# Altium project HYDRA_V3_NAV.PrjPcb (part 1 of 2)
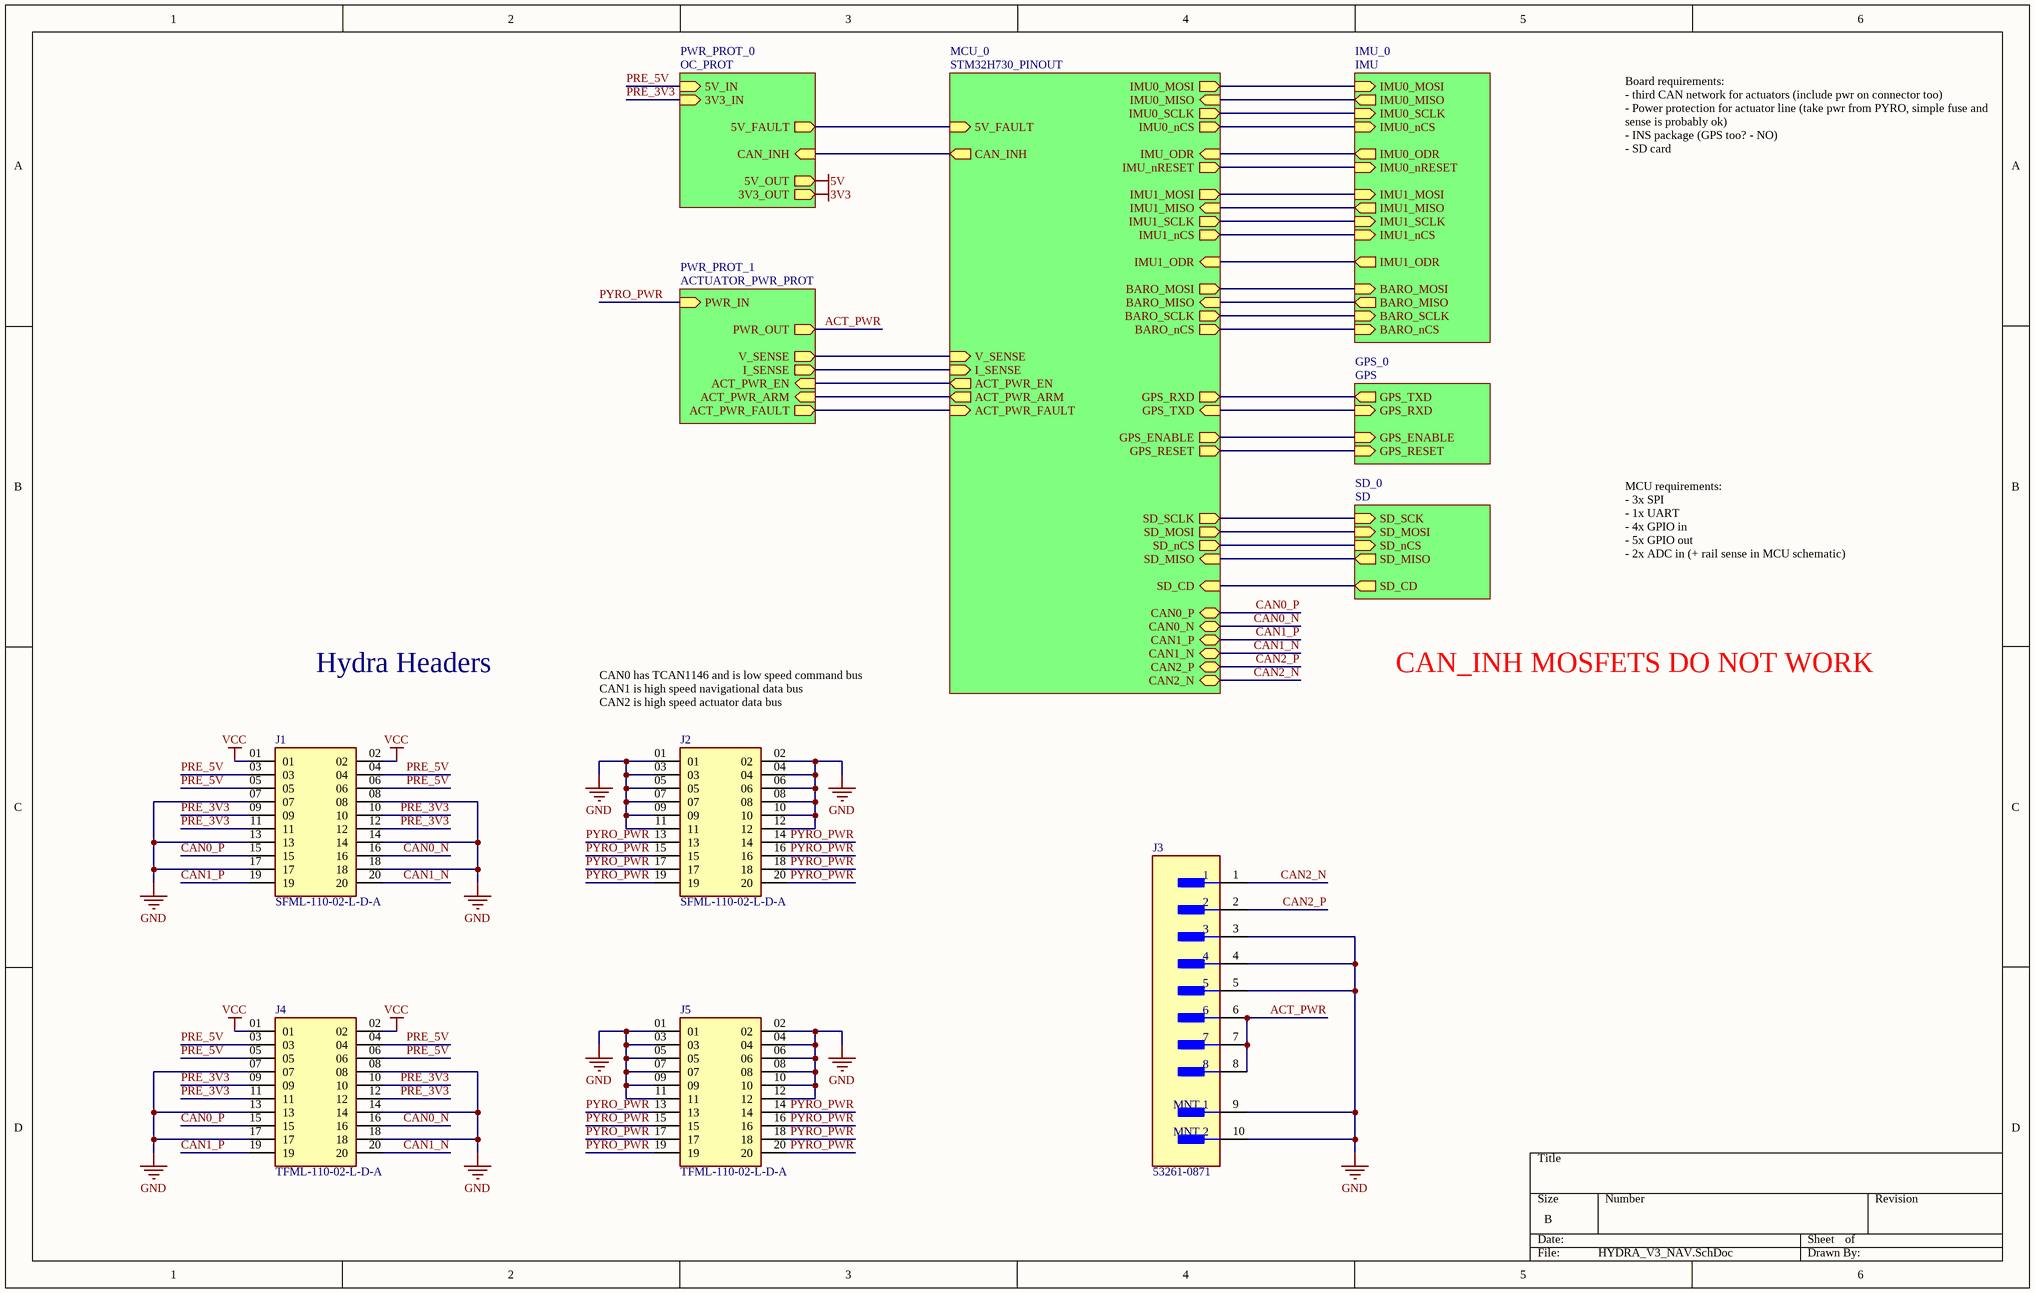
[diagram p0: HYDRA_V3_NAV.SchDoc]
7 sheets, 169 parts. Net scope: hierarchical (ports join the sheet entries above them; power ports are global).
Board file: HYDRA_V3_NAV.PcbDoc
Sheets:
  HYDRA_V3_NAV.SchDoc
    MCU_0 = STM32H730_PINOUT.SchDoc
    IMU_0 = IMU.SchDoc
    GPS_0 = GPS.SchDoc
    SD_0 = SD.SchDoc
    PWR_PROT_0 = OC_PROT.SchDoc
    PWR_PROT_1 = ACTUATOR_PWR_PROT.SchDoc

## Sheet HYDRA_V3_NAV.SchDoc
size B; SheetNumber: 1; SheetTotal: 7

### Parts
J1  SFML-110-02-L-D-A  [SFML-110-02-L-D-A-Footprint-1]
J2  SFML-110-02-L-D-A  [SFML-110-02-L-D-A-Footprint-1]
J3  53261-0871  [FP-532610871-MFG]
J4  TFML-110-02-L-D-A  [TFML-110-02-L-D-A-Footprint-1]
J5  TFML-110-02-L-D-A  [TFML-110-02-L-D-A-Footprint-1]

### Sub-sheets
GPS_0 = GPS: GPS_TXD (out), GPS_RXD (in), GPS_ENABLE (in), GPS_RESET (in)
IMU_0 = IMU: IMU0_MOSI (in), IMU0_MISO (out), IMU0_SCLK (in), IMU0_nCS (in), IMU0_ODR (out), IMU0_nRESET (in), IMU1_MOSI (in), IMU1_MISO (out), IMU1_SCLK (in), IMU1_nCS (in), IMU1_ODR (out), BARO_MOSI (in), BARO_MISO (out), BARO_SCLK (in), BARO_nCS (in)
MCU_0 = STM32H730_PINOUT: IMU_ODR (in), IMU_nRESET (out), BARO_MOSI (out), BARO_MISO (in), BARO_SCLK (out), BARO_nCS (out), V_SENSE (in), I_SENSE (in), 5V_FAULT (in), GPS_RXD (out), GPS_TXD (in), GPS_ENABLE (out), GPS_RESET (out), SD_SCLK (out), SD_MOSI (out), SD_nCS (out), SD_MISO (in), SD_CD (in), CAN0_P (bidir), CAN0_N (bidir), CAN1_P (bidir), CAN1_N (bidir), CAN2_P (bidir), CAN2_N (bidir), IMU1_MOSI (out), IMU1_MISO (in), IMU1_SCLK (out), IMU1_nCS (out), IMU1_ODR (in), CAN_INH (out), ACT_PWR_EN (out), ACT_PWR_ARM (out), ACT_PWR_FAULT (in), IMU0_MOSI (out), IMU0_MISO (in), IMU0_SCLK (out), IMU0_nCS (out)
PWR_PROT_0 = OC_PROT: 5V_OUT (out), 5V_IN (in), 3V3_IN (in), 3V3_OUT (out), 5V_FAULT (out), CAN_INH (in)
PWR_PROT_1 = ACTUATOR_PWR_PROT: PWR_IN (in), PWR_OUT (out), V_SENSE (out), I_SENSE (out), ACT_PWR_EN (in), ACT_PWR_ARM (in), ACT_PWR_FAULT (out)
SD_0 = SD: SD_SCK (in), SD_MOSI (in), SD_nCS (in), SD_MISO (out), SD_CD (out)

### Nets
5V: sheet PWR_PROT_0/5V_OUT
GND: J1.07 J1.08 J1.13 J1.14 J1.17 J1.18 J2.01 J2.02 J2.03 J2.04 J2.05 J2.06 J2.07 J2.08 J2.09 J2.10 J2.11 J2.12 J3.3 J3.4 J3.5 J3.9(MNT_1) J3.10(MNT_2) J4.07 J4.08 J4.13 J4.14 J4.17 J4.18 J5.01 J5.02 J5.03 J5.04 J5.05 J5.06 J5.07 J5.08 J5.09 J5.10 J5.11 J5.12
VCC: J1.01 J1.02 J4.01 J4.02
5V_FAULT: sheet MCU_0/5V_FAULT, sheet PWR_PROT_0/5V_FAULT
ACT_PWR: J3.6 J3.7 J3.8 ; sheet PWR_PROT_1/PWR_OUT
ACT_PWR_ARM: sheet MCU_0/ACT_PWR_ARM, sheet PWR_PROT_1/ACT_PWR_ARM
ACT_PWR_EN: sheet MCU_0/ACT_PWR_EN, sheet PWR_PROT_1/ACT_PWR_EN
ACT_PWR_FAULT: sheet MCU_0/ACT_PWR_FAULT, sheet PWR_PROT_1/ACT_PWR_FAULT
BARO_MISO: sheet MCU_0/BARO_MISO, sheet IMU_0/BARO_MISO
BARO_MOSI: sheet MCU_0/BARO_MOSI, sheet IMU_0/BARO_MOSI
BARO_nCS: sheet MCU_0/BARO_nCS, sheet IMU_0/BARO_nCS
BARO_SCLK: sheet MCU_0/BARO_SCLK, sheet IMU_0/BARO_SCLK
CAN0_N: J1.16 J4.16 ; sheet MCU_0/CAN0_N
CAN0_P: J1.15 J4.15 ; sheet MCU_0/CAN0_P
CAN1_N: J1.20 J4.20 ; sheet MCU_0/CAN1_N
CAN1_P: J1.19 J4.19 ; sheet MCU_0/CAN1_P
CAN2_N: J3.1 ; sheet MCU_0/CAN2_N
CAN2_P: J3.2 ; sheet MCU_0/CAN2_P
CAN_INH: sheet MCU_0/CAN_INH, sheet PWR_PROT_0/CAN_INH
GPS_ENABLE: sheet MCU_0/GPS_ENABLE, sheet GPS_0/GPS_ENABLE
GPS_RESET: sheet MCU_0/GPS_RESET, sheet GPS_0/GPS_RESET
I_SENSE: sheet MCU_0/I_SENSE, sheet PWR_PROT_1/I_SENSE
IMU0_MISO: sheet MCU_0/IMU0_MISO, sheet IMU_0/IMU0_MISO
IMU0_MOSI: sheet MCU_0/IMU0_MOSI, sheet IMU_0/IMU0_MOSI
IMU0_nCS: sheet MCU_0/IMU0_nCS, sheet IMU_0/IMU0_nCS
IMU0_nRESET: sheet MCU_0/IMU_nRESET, sheet IMU_0/IMU0_nRESET
IMU0_ODR: sheet MCU_0/IMU_ODR, sheet IMU_0/IMU0_ODR
IMU0_SCLK: sheet MCU_0/IMU0_SCLK, sheet IMU_0/IMU0_SCLK
IMU1_MISO: sheet MCU_0/IMU1_MISO, sheet IMU_0/IMU1_MISO
IMU1_MOSI: sheet MCU_0/IMU1_MOSI, sheet IMU_0/IMU1_MOSI
IMU1_nCS: sheet MCU_0/IMU1_nCS, sheet IMU_0/IMU1_nCS
IMU1_ODR: sheet MCU_0/IMU1_ODR, sheet IMU_0/IMU1_ODR
IMU1_SCLK: sheet MCU_0/IMU1_SCLK, sheet IMU_0/IMU1_SCLK
PRE_3V3: J1.09 J1.10 J1.11 J1.12 J4.09 J4.10 J4.11 J4.12 ; sheet PWR_PROT_0/3V3_IN  [project net 3V3_PRE_SHUNT]
PRE_5V: J1.03 J1.04 J1.05 J1.06 J4.03 J4.04 J4.05 J4.06 ; sheet PWR_PROT_0/5V_IN
PYRO_PWR: J2.13 J2.14 J2.15 J2.16 J2.17 J2.18 J2.19 J2.20 J5.13 J5.14 J5.15 J5.16 J5.17 J5.18 J5.19 J5.20 ; sheet PWR_PROT_1/PWR_IN  [project net PRE_SHUNT]
RXD: sheet MCU_0/GPS_TXD, sheet GPS_0/GPS_RXD
SD_CD: sheet MCU_0/SD_CD, sheet SD_0/SD_CD
SD_CLK: sheet MCU_0/SD_SCLK, sheet SD_0/SD_SCK
SD_CMD: sheet MCU_0/SD_MOSI, sheet SD_0/SD_MOSI
SD_CS: sheet MCU_0/SD_nCS, sheet SD_0/SD_nCS
SD_DAT0: sheet MCU_0/SD_MISO, sheet SD_0/SD_MISO
TXD: sheet MCU_0/GPS_RXD, sheet GPS_0/GPS_TXD
V_SENSE: sheet MCU_0/V_SENSE, sheet PWR_PROT_1/V_SENSE

### Notes on the sheet
- Board requirements:
  - third CAN network for actuators (include pwr on connector too)
  - Power protection for actuator line (take pwr from PYRO, simple fuse and sense is probably ok)
  - INS package (GPS too? - NO)
  - SD card
- MCU requirements:
  - 3x SPI
  - 1x UART
  - 4x GPIO in
  - 5x GPIO out
  - 2x ADC in (+ rail sense in MCU schematic)
- Hydra Headers
- CAN0 has TCAN1146 and is low speed command bus
  CAN1 is high speed navigational data bus
  CAN2 is high speed actuator data bus
- CAN_INH MOSFETS DO NOT WORK

### Library data of the parts
J1 J2 = CMP-002-00043-1: Board Connector, 20 Contact(s), 2 Row(s), Female, Straight, 0.05 inch Pitch, Surface Mount Terminal, Locking, Black Insulator, Socket; RoHS Compliant: Yes; Connector Type: BOARD CONNECTOR; Mounting Technology: Board
J3 = CMP-002-00053-1: Board Connector, 8 Contact(s), 1 Row(s), Male, Right Angle, 0.049 inch Pitch, Surface Mount Terminal, Locking, Natural Insulator, Receptacle; RoHS Compliant: Yes; Max Operating Temperature: 85°C; Min Operating Temperature: -40°C; Connector Type: BOARD CONNECTOR; Mounting Technology: Board
J4 J5 = CMP-002-00042-1: Board Connector, 20 Contact(s), 2 Row(s), Male, Straight, Surface Mount Terminal; Connector Type: BOARD CONNECTOR; Mounting Technology: Board; RoHS Compliant: Yes

## Sheet STM32H730_PINOUT.SchDoc
size D; SheetNumber: 3; SheetTotal: 7
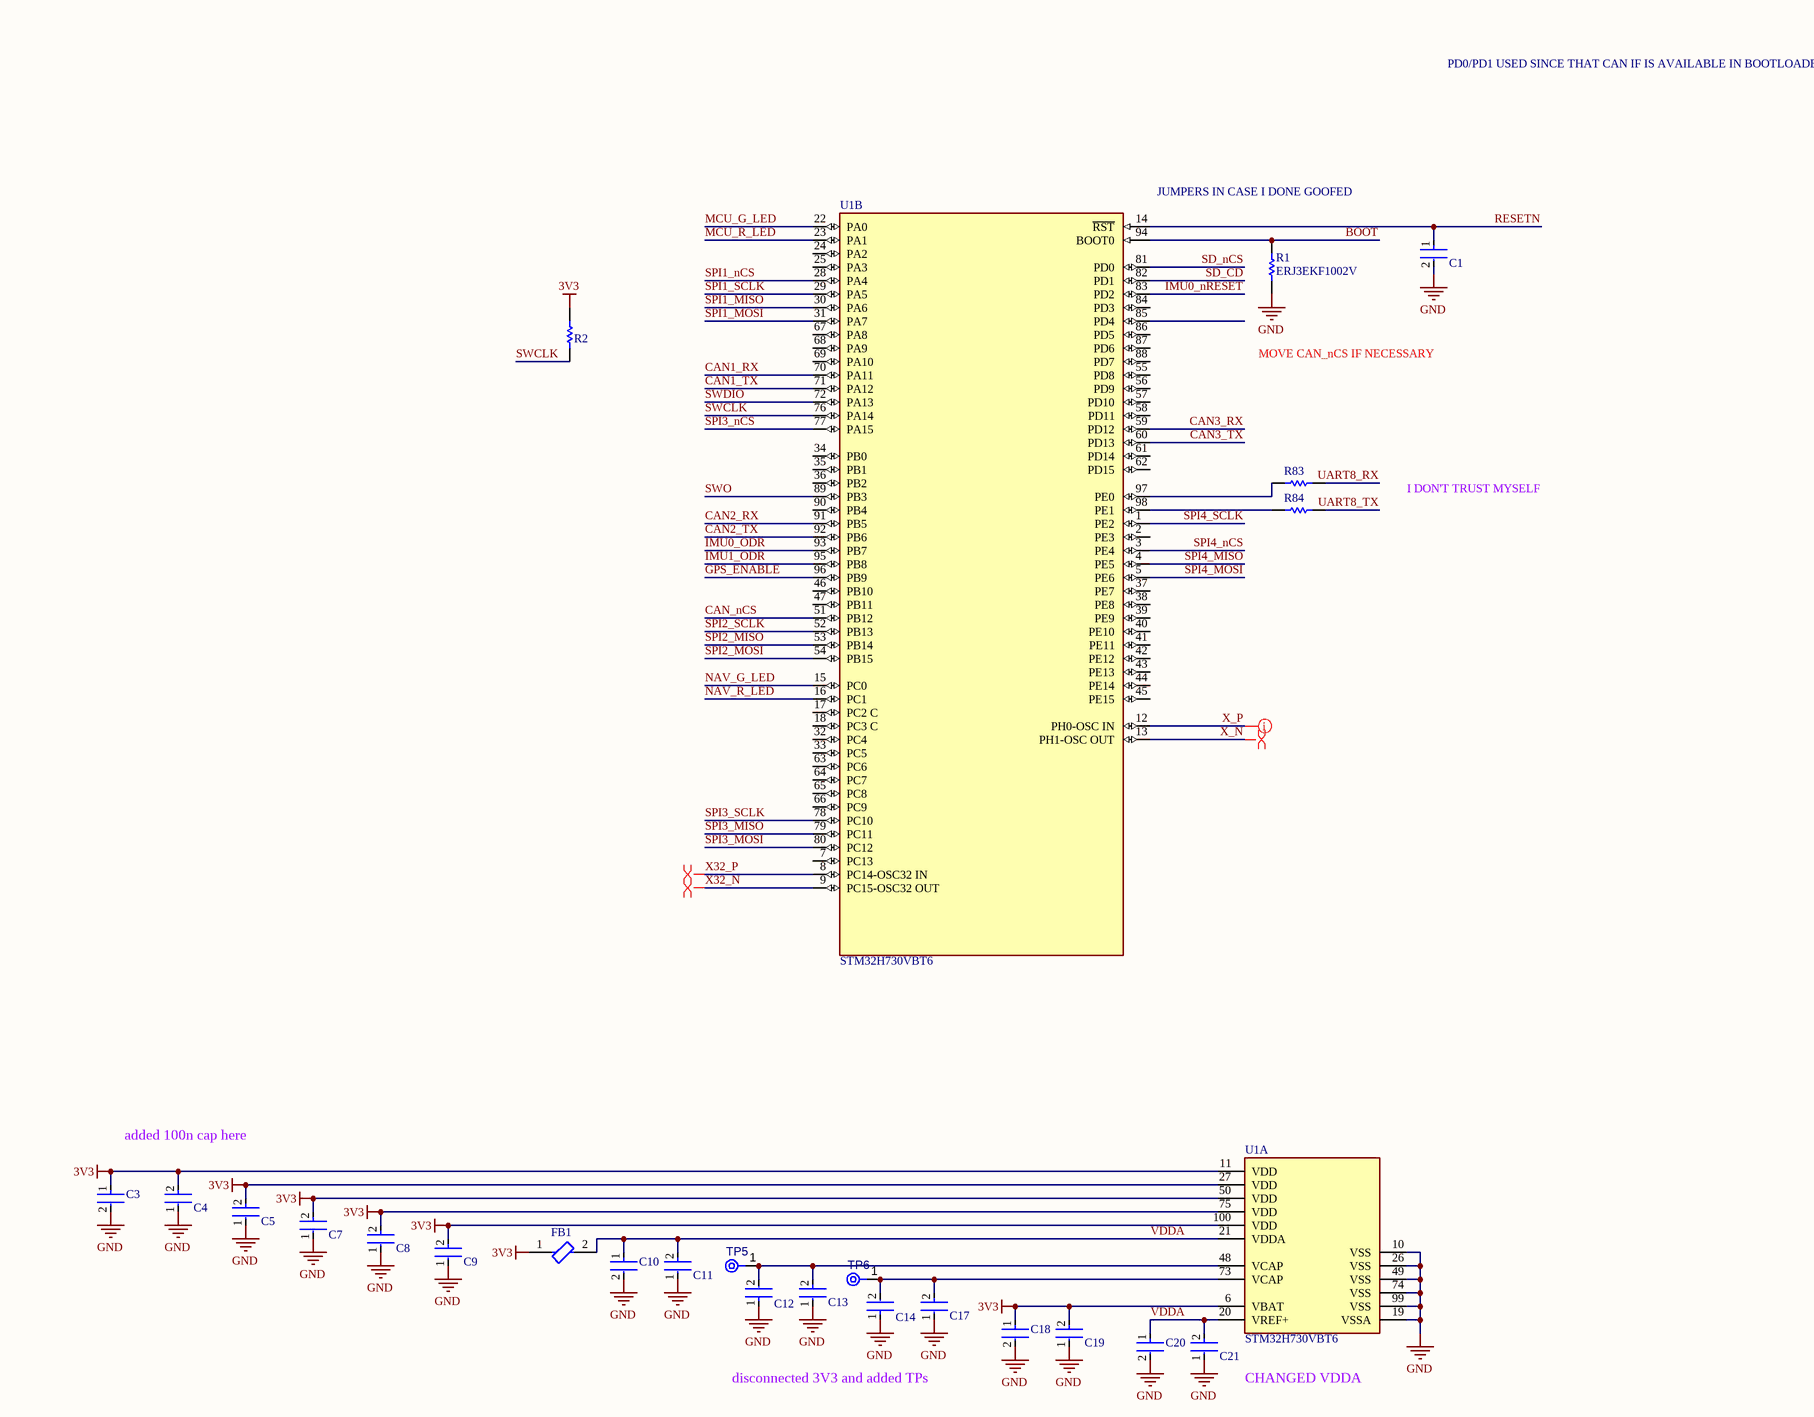
[diagram p1: STM32H730_PINOUT.SchDoc, top left]
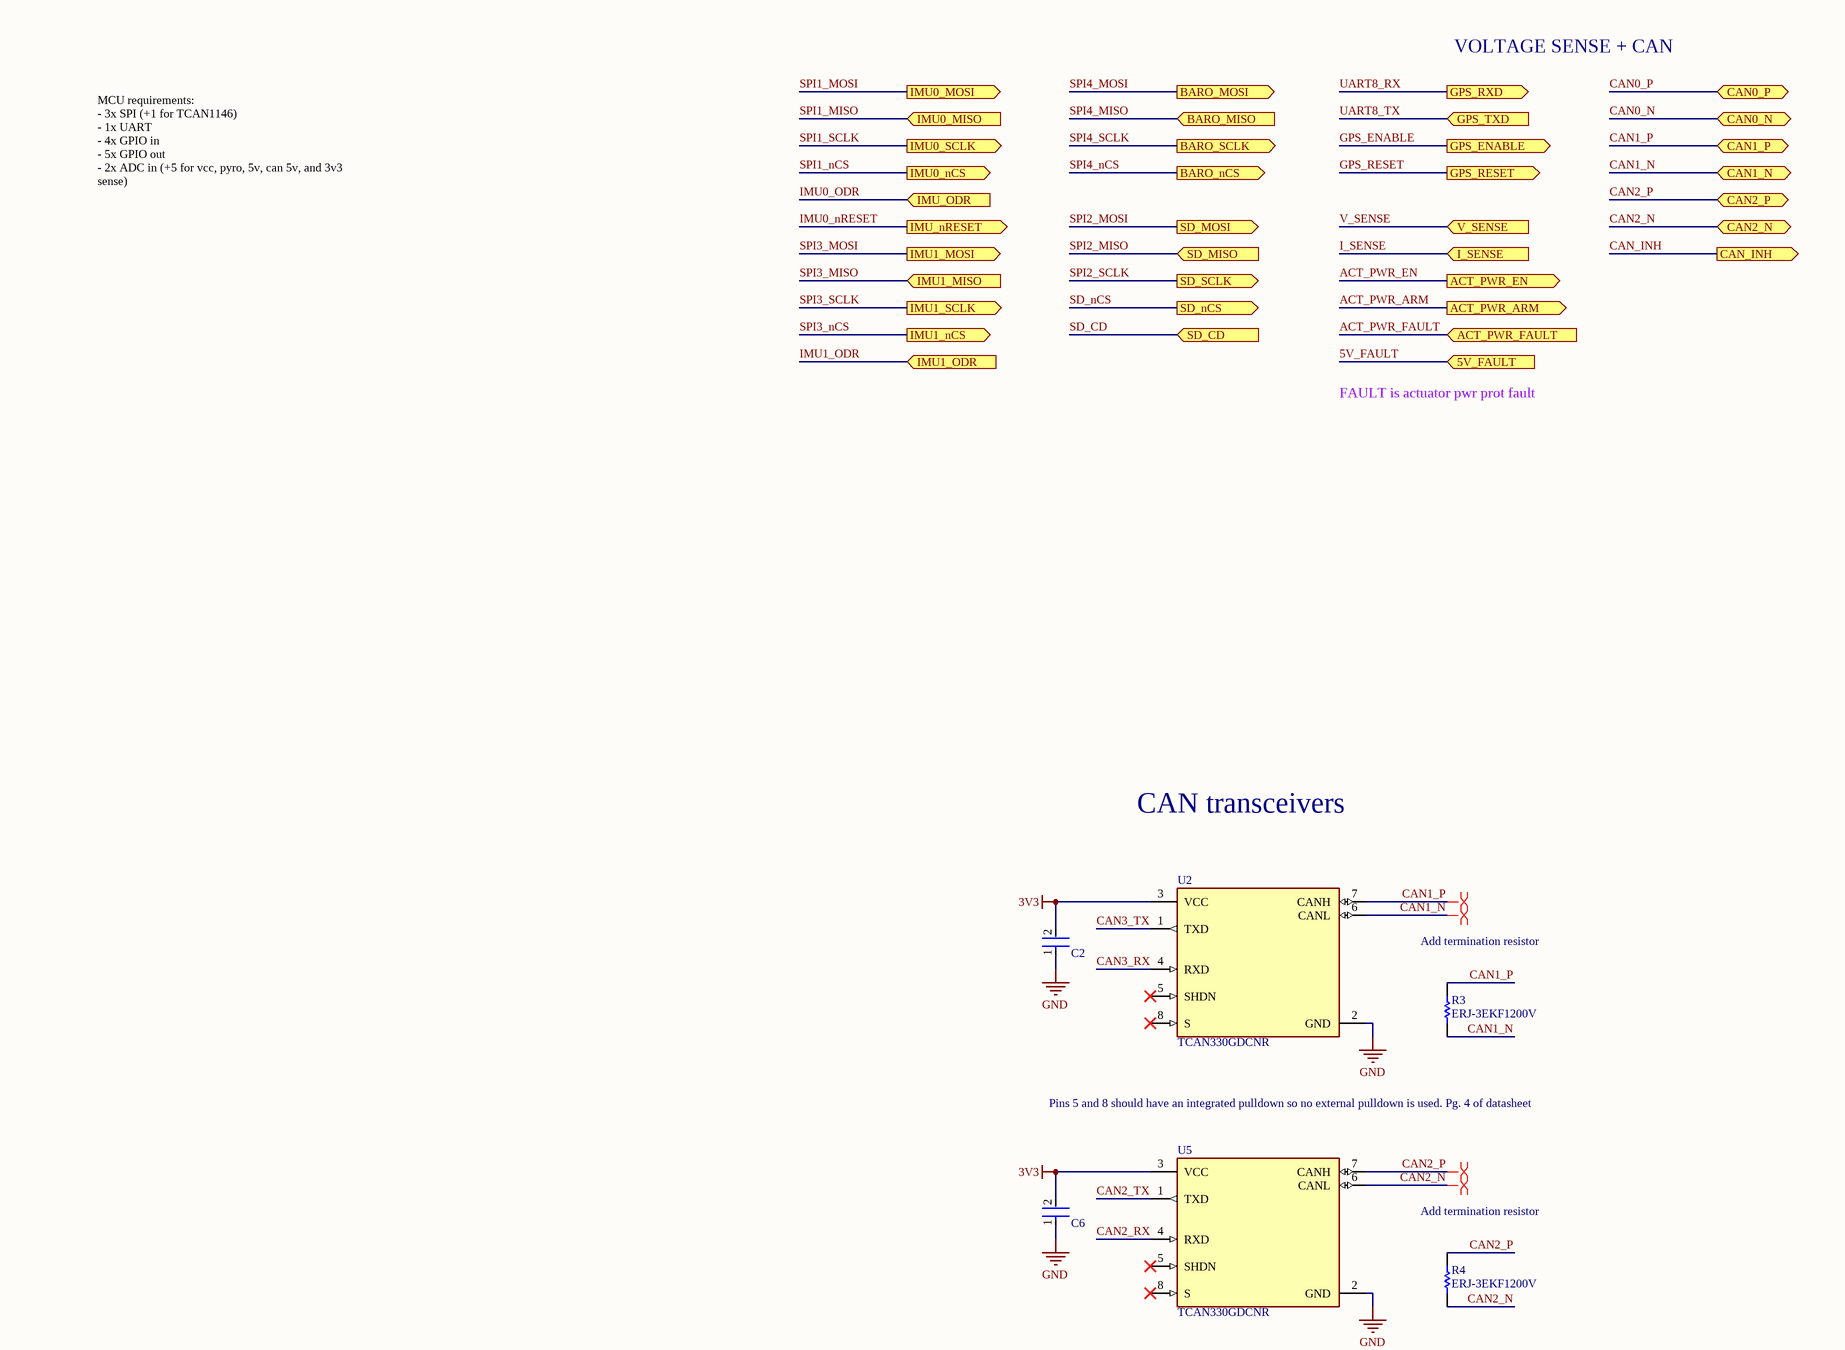
[diagram p2: STM32H730_PINOUT.SchDoc, top right]
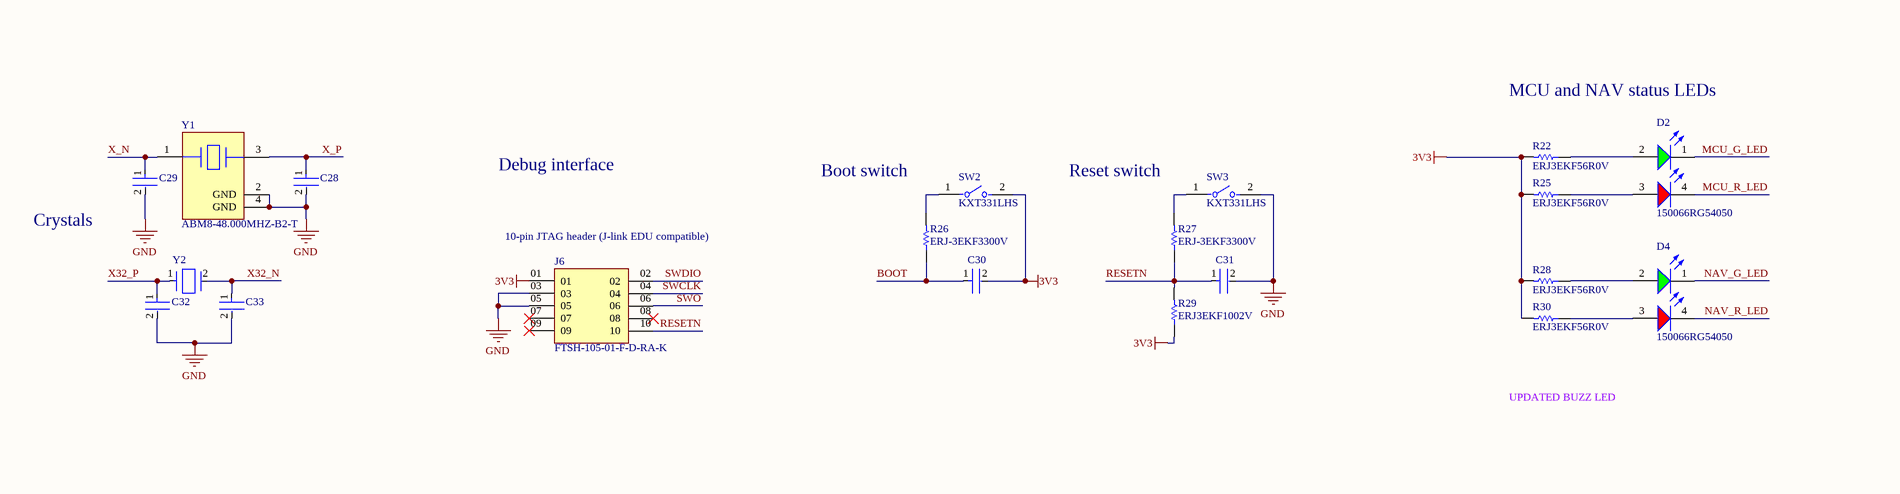
[diagram p3: STM32H730_PINOUT.SchDoc, bottom left]
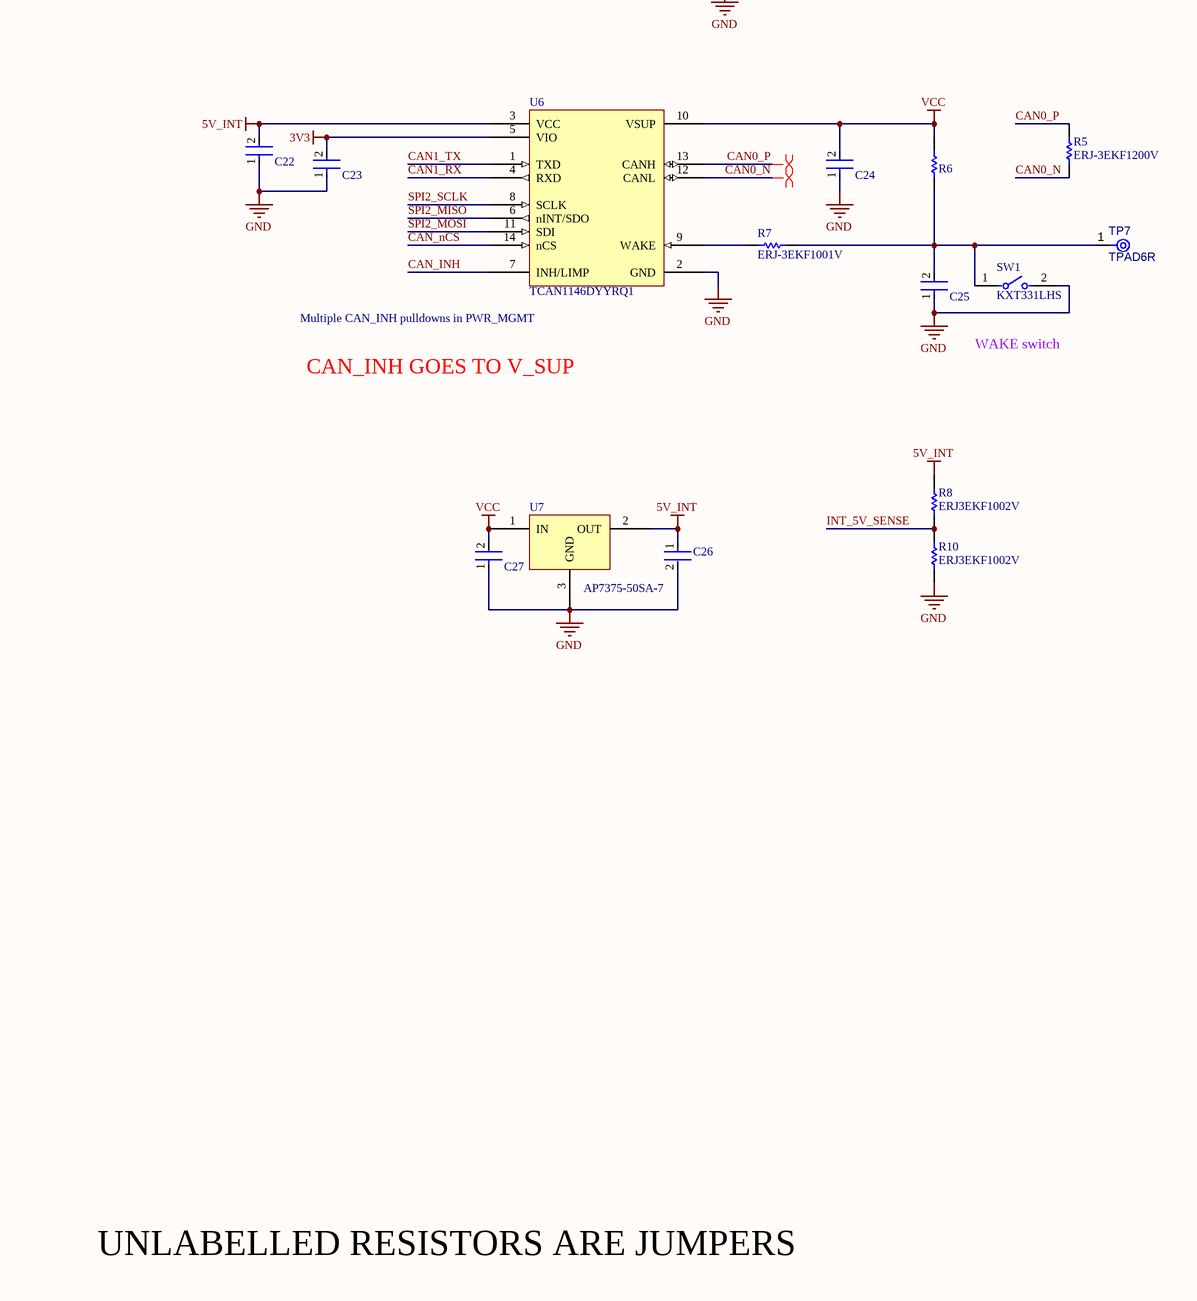
[diagram p4: STM32H730_PINOUT.SchDoc, bottom right]

### Parts
C1  C0402C104K8PACTU  [FP-C0402-BB-MFG]  (value not drawn)
C2  C0402C104K8PACTU  [FP-C0402-BB-MFG]  (value not drawn)
C3  C1005X5R1A475K050BC  [FP-C1005-050-0_15-MFG]  (value not drawn)
C4  GRM155R71C104KA88D  [FP-GRM15-MFG]  (value not drawn)
C5  GRM155R71C104KA88D  [FP-GRM15-MFG]  (value not drawn)
C6  C0402C104K8PACTU  [FP-C0402-BB-MFG]  (value not drawn)
C7  GRM155R71C104KA88D  [FP-GRM15-MFG]  (value not drawn)
C8  GRM155R71C104KA88D  [FP-GRM15-MFG]  (value not drawn)
C9  GRM155R71C104KA88D  [FP-GRM15-MFG]  (value not drawn)
C10  EMK105BJ105KV-F  [FP-0402-L_1_0_0_05-W_0_5-IPC_A]  (value not drawn)
C11  GRM155R71C104KA88D  [FP-GRM15-MFG]  (value not drawn)
C12  C1005X7S1A225K050BC  [FP-C1005-050-0_15-0_1-MFG]  (value not drawn)
C13  GRM155R71C104KA88D  [FP-GRM15-MFG]  (value not drawn)
C14  C1005X7S1A225K050BC  [FP-C1005-050-0_15-0_1-MFG]  (value not drawn)
C17  GRM155R71C104KA88D  [FP-GRM15-MFG]  (value not drawn)
C18  EMK105BJ105KV-F  [FP-0402-L_1_0_0_05-W_0_5-IPC_A]  (value not drawn)
C19  GRM155R71C104KA88D  [FP-GRM15-MFG]  (value not drawn)
C20  EMK105BJ105KV-F  [FP-0402-L_1_0_0_05-W_0_5-IPC_A]  (value not drawn)
C21  GRM155R71C104KA88D  [FP-GRM15-MFG]  (value not drawn)
C22  C0402C104K8PACTU  [FP-C0402-BB-MFG]  (value not drawn)
C23  C0402C104K8PACTU  [FP-C0402-BB-MFG]  (value not drawn)
C24  C0402C104K8PACTU  [FP-C0402-BB-MFG]  (value not drawn)
C25  C0402C104K8PACTU  [FP-C0402-BB-MFG]  (value not drawn)
C26  CL05A106MP5NUNC  [FP-CL05A106MP5NUNC-MFG]  (value not drawn)
C27  C0402C104K8PACTU  [FP-C0402-BB-MFG]  (value not drawn)
C28  C0402C689C5GACTU  [FP-C0402-BB-MFG]  (value not drawn)
C29  C0402C689C5GACTU  [FP-C0402-BB-MFG]  (value not drawn)
C30  C0402C104K8PACTU  [FP-C0402-BB-MFG]  (value not drawn)
C31  C0402C104K8PACTU  [FP-C0402-BB-MFG]  (value not drawn)
C32  04025A180FAT2A  [FP-0402-L_1_0_1-W_0_5_0_1-IPC_A]  (value not drawn)
C33  04025A180FAT2A  [FP-0402-L_1_0_1-W_0_5_0_1-IPC_A]  (value not drawn)
D2  150066RG54050  [WL-SBCD_0606]
D4  150066RG54050  [WL-SBCD_0606]
FB1  BLM15PX601SN1D  [FP-BLM15-0_05-MFG]  (value not drawn)
J6  FTSH-105-01-F-D-RA-K  [FTSH-105-01-F-D-RA-K-Footprint-1]
R1  ERJ3EKF1002V  [RESC1609X55X30LL15T15]
R2  ERJ3EKF1002V  [RESC1609X55X30LL15T15]  (value not drawn)
R3  ERJ-3EKF1200V  [RESC1609X55X30ML15T15]
R4  ERJ-3EKF1200V  [RESC1609X55X30ML15T15]
R5  ERJ-3EKF1200V  [RESC1609X55X30ML15T15]
R6  ERJ3EKF1002V  [RESC1609X55X30LL15T15]  (value not drawn)
R7  ERJ-3EKF1001V  [RESC1608X55X30LL15T15]
R8  ERJ3EKF1002V  [RESC1609X55X30LL15T15]
R10  ERJ3EKF1002V  [RESC1609X55X30LL15T15]
R22  ERJ3EKF56R0V  [RESC1608X55X30NL15T15]
R25  ERJ3EKF56R0V  [RESC1608X55X30NL15T15]
R26  ERJ-3EKF3300V  [RESC1608X55X30LL15T15]
R27  ERJ-3EKF3300V  [RESC1608X55X30LL15T15]
R28  ERJ3EKF56R0V  [RESC1608X55X30NL15T15]
R29  ERJ3EKF1002V  [RESC1609X55X30LL15T15]
R30  ERJ3EKF56R0V  [RESC1608X55X30NL15T15]
R83  0402 JUMPER  [RESC1005X40X25ML05T05]  (value not drawn)
R84  0402 JUMPER  [RESC1005X40X25ML05T05]  (value not drawn)
SW1  KXT331LHS  [FP-KXT331LHS-MFG]
SW2  KXT331LHS  [FP-KXT331LHS-MFG]
SW3  KXT331LHS  [FP-KXT331LHS-MFG]
TP5  TPAD6R  [TP06R]  (value not drawn)  (no BOM)
TP6  TPAD6R  [TP06R]  (value not drawn)  (no BOM)
TP7  TPAD6R  [TP06R]  (no BOM)
U1  STM32H730VBT6  [FP-LQFP100-1L-IPC_C]  (parts A,B of 2)
U2  TCAN330GDCNR  [FP-DCN0008A-MFG]
U5  TCAN330GDCNR  [FP-DCN0008A-MFG]
U6  TCAN1146DYYRQ1  [TCAN1146DYYRQ1-Footprint-1]
U7  AP7375-50SA-7  [AP7375-50SA-7-Footprint-1]
Y1  ABM8-48.000MHZ-B2-T  [FP-ABM8-MFG]
Y2  ECS-.327-12.5-1210-TR  [FP-ECX-1210-MFG]  (value not drawn)

### Ports
5V_FAULT (in, see HYDRA_V3_NAV[3A]), ACT_PWR_ARM (out, see HYDRA_V3_NAV[3B]), ACT_PWR_EN (out, see HYDRA_V3_NAV[3B], ACTUATOR_PWR_PROT[1A]), ACT_PWR_FAULT (in, see HYDRA_V3_NAV[3B], ACTUATOR_PWR_PROT[5A]), BARO_MISO (in, see HYDRA_V3_NAV[4A], IMU[5A]), BARO_MOSI (out, see HYDRA_V3_NAV[4A], IMU[5A]), BARO_nCS (out, see HYDRA_V3_NAV[4B], IMU[5A]), BARO_SCLK (out, see HYDRA_V3_NAV[4A], IMU[5A]), CAN0_N (bidir, see HYDRA_V3_NAV[4B]), CAN0_P (bidir, see HYDRA_V3_NAV[4B]), CAN1_N (bidir, see HYDRA_V3_NAV[4C]), CAN1_P (bidir, see HYDRA_V3_NAV[4B]), CAN2_N (bidir, see HYDRA_V3_NAV[4C]), CAN2_P (bidir, see HYDRA_V3_NAV[4C]), CAN_INH (out, see HYDRA_V3_NAV[3A], OC_PROT[1B]), GPS_ENABLE (out, see HYDRA_V3_NAV[4B], GPS[5A]), GPS_RESET (out, see HYDRA_V3_NAV[4B], GPS[5A]), GPS_RXD (out, see HYDRA_V3_NAV[4B]), GPS_TXD (in, see HYDRA_V3_NAV[4B]), I_SENSE (in, see HYDRA_V3_NAV[3B], ACTUATOR_PWR_PROT[5A]), IMU0_MISO (in, see HYDRA_V3_NAV[4A], IMU[5A]), IMU0_MOSI (out, see HYDRA_V3_NAV[4A], IMU[5A]), IMU0_nCS (out, see HYDRA_V3_NAV[4A], IMU[5A]), IMU0_SCLK (out, see HYDRA_V3_NAV[4A], IMU[5A]), IMU1_MISO (in, see HYDRA_V3_NAV[4A], IMU[5B]), IMU1_MOSI (out, see HYDRA_V3_NAV[4A], IMU[5B]), IMU1_nCS (out, see HYDRA_V3_NAV[4A], IMU[5B]), IMU1_ODR (in, see HYDRA_V3_NAV[4A], IMU[5B]), IMU1_SCLK (out, see HYDRA_V3_NAV[4A], IMU[5B]), IMU_nRESET (out, see HYDRA_V3_NAV[4A]), IMU_ODR (in, see HYDRA_V3_NAV[4A]), SD_CD (in, see HYDRA_V3_NAV[4B], SD[5A]), SD_MISO (in, see HYDRA_V3_NAV[4B], SD[4B]), SD_MOSI (out, see HYDRA_V3_NAV[4B], SD[4B]), SD_nCS (out, see HYDRA_V3_NAV[4B], SD[4C]), SD_SCLK (out, see HYDRA_V3_NAV[4B]), V_SENSE (in, see HYDRA_V3_NAV[3B], ACTUATOR_PWR_PROT[5A])

### Nets
3V3: C2.2 C3.1 C4.2 C5.2 C6.2 C7.2 C8.2 C9.2 C18.1 C19.2 C23.2 C30.2 FB1.1 J6.01 R2.1 R22.2 R25.2 R28.2 R29.1 R30.2 SW2.2 U1.6(VBAT) U1.11(VDD) U1.27(VDD) U1.50(VDD) U1.75(VDD) U1.100(VDD) U2.3(VCC) U5.3(VCC) U6.5(VIO)
5V_INT: C22.2 C26.1 R8.2 U6.3(VCC) U7.2(OUT)
GND: C1.2 C2.1 C3.2 C4.1 C5.1 C6.1 C7.1 C8.1 C9.1 C10.2 C11.1 C12.1 C13.1 C14.1 C17.1 C18.2 C19.1 C20.2 C21.1 C22.1 C23.1 C24.1 C25.1 C26.2 C27.1 C28.2 C29.2 C31.2 C32.2 C33.2 J6.03 J6.05 R1.1 R10.2 SW1.2 SW3.2 U1.10(VSS) U1.19(VSSA) U1.26(VSS) U1.49(VSS) U1.74(VSS) U1.99(VSS) U2.2(GND) U5.2(GND) U6.2(GND) U7.3(GND) Y1.2(GND) Y1.4(GND)
VCC: C24.2 C27.2 R6.1 U6.10(VSUP) U7.1(IN)
5V_FAULT: port 5V_FAULT
ACT_PWR_ARM: port ACT_PWR_ARM
ACT_PWR_EN: port ACT_PWR_EN
BOOT: C30.1 R1.2 R26.1 U1.94(BOOT0)
CAN0_N: R5.2 U6.12(CANL) ; port CAN0_N
CAN0_P: R5.1 U6.13(CANH) ; port CAN0_P
CAN1_N: R3.1 U2.6(CANL) ; port CAN1_N
CAN1_P: R3.2 U2.7(CANH) ; port CAN1_P
CAN1_RX: U1.70(PA11) U6.4(RXD)
CAN1_TX: U1.71(PA12) U6.1(TXD)
CAN2_N: R4.1 U5.6(CANL) ; port CAN2_N
CAN2_P: R4.2 U5.7(CANH) ; port CAN2_P
CAN2_RX: U1.91(PB5) U5.4(RXD)
CAN2_TX: U1.92(PB6) U5.1(TXD)
CAN3_RX: U1.59(PD12) U2.4(RXD)
CAN3_TX: U1.60(PD13) U2.1(TXD)
CAN_INH: U6.7(INH/LIMP) ; port CAN_INH
CAN_nCS: U1.51(PB12) U6.14(nCS)
GPS_ENABLE: U1.96(PB9) ; port GPS_ENABLE
IMU0_nRESET: U1.83(PD2) ; port IMU_nRESET
IMU0_ODR: U1.93(PB7) ; port IMU_ODR
IMU1_ODR: U1.95(PB8) ; port IMU1_ODR
INT_5V_SENSE: R8.1 R10.1
MCU_G_LED: D2.1(K) U1.22(PA0)
MCU_R_LED: D2.4(K) U1.23(PA1)
NAV_G_LED: D4.1(K) U1.15(PC0)
NAV_R_LED: D4.4(K) U1.16(PC1)
RESETN: C1.1 C31.1 J6.10 R27.1 R29.2 U1.14(~{RST})
SD_CD: U1.82(PD1) ; port SD_CD
SD_nCS: U1.81(PD0) ; port SD_nCS  [project net SD_CS]
SPI1_MISO: U1.30(PA6) ; port IMU0_MISO  [project net IMU0_MISO]
SPI1_MOSI: U1.31(PA7) ; port IMU0_MOSI  [project net IMU0_MOSI]
SPI1_nCS: U1.28(PA4) ; port IMU0_nCS  [project net IMU0_nCS]
SPI1_SCLK: U1.29(PA5) ; port IMU0_SCLK  [project net IMU0_SCLK]
SPI2_MISO: U1.53(PB14) U6.6(nINT/SDO) ; port SD_MISO  [project net SD_DAT0]
SPI2_MOSI: U1.54(PB15) U6.11(SDI) ; port SD_MOSI  [project net SD_CMD]
SPI2_SCLK: U1.52(PB13) U6.8(SCLK) ; port SD_SCLK  [project net SD_CLK]
SPI3_MISO: U1.79(PC11) ; port IMU1_MISO  [project net IMU1_MISO]
SPI3_MOSI: U1.80(PC12) ; port IMU1_MOSI  [project net IMU1_MOSI]
SPI3_nCS: U1.77(PA15) ; port IMU1_nCS  [project net IMU1_nCS]
SPI3_SCLK: U1.78(PC10) ; port IMU1_SCLK  [project net IMU1_SCLK]
SPI4_MISO: U1.4(PE5) ; port BARO_MISO  [project net BARO_MISO]
SPI4_MOSI: U1.5(PE6) ; port BARO_MOSI  [project net BARO_MOSI]
SPI4_nCS: U1.3(PE4) ; port BARO_nCS  [project net BARO_nCS]
SPI4_SCLK: U1.1(PE2) ; port BARO_SCLK  [project net BARO_SCLK]
SWCLK: J6.04 R2.2 U1.76(PA14)
SWDIO: J6.02 U1.72(PA13)
SWO: J6.06 U1.89(PB3)
UART8_RX: R83.2 ; port GPS_RXD  [project net TXD]
UART8_TX: R84.2 ; port GPS_TXD  [project net RXD]
VDDA: C10.1 C11.2 C20.1 C21.2 FB1.2 U1.20(VREF+) U1.21(VDDA)
X32_N: C33.1 U1.9(PC15-OSC32_OUT) Y2.2(Out/In)
X32_P: C32.1 U1.8(PC14-OSC32_IN) Y2.1(In/Out)
X_N: C29.1 U1.13(PH1-OSC_OUT) Y1.1
X_P: C28.1 U1.12(PH0-OSC_IN) Y1.3
NetC12_2: C12.2 C13.2 TP5.1(TP) U1.48(VCAP)
NetC14_2: C14.2 C17.2 TP6.1(TP) U1.73(VCAP)
NetC25_2: C25.2 R6.2 R7.2 SW1.1 TP7.1(TP)
NetD2_2: D2.2(A) R22.1
NetD2_3: D2.3(A) R25.1
NetD4_2: D4.2(A) R28.1
NetD4_3: D4.3(A) R30.1
NetR7_1: R7.1 U6.9(WAKE)
NetR26_2: R26.2 SW2.1
NetR27_2: R27.2 SW3.1
NetR83_1: R83.1 U1.97(PE0)
NetR84_1: R84.1 U1.98(PE1)

Not connected (* = marked no-connect by the designer): J6 07* 08* 09*; U1 2(PE3) 7(PC13) 17(PC2_C) 18(PC3_C) 24(PA2) 25(PA3) 32(PC4) 33(PC5) 34(PB0) 35(PB1) 36(PB2) 37(PE7) 38(PE8) 39(PE9) 40(PE10) 41(PE11) 42(PE12) 43(PE13) 44(PE14) 45(PE15) 46(PB10) 47(PB11) 55(PD8) 56(PD9) 57(PD10) 58(PD11) 61(PD14) 62(PD15) 63(PC6) 64(PC7) 65(PC8) 66(PC9) 67(PA8) 68(PA9) 69(PA10) 84(PD3) 85(PD4) 86(PD5) 87(PD6) 88(PD7) 90(PB4); U2 5(SHDN)* 8(S)*; U5 5(SHDN)* 8(S)*

### Layout directives
differential pair: CAN1_N, CAN1_P, CAN2_N, CAN2_P, X32_N, X32_P, X_N, X_P
differential pair; differential pair class 120DIFF: CAN0_N, CAN0_P

### Notes on the sheet
- PD0/PD1 USED SINCE THAT CAN IF IS AVAILABLE IN BOOTLOADER MODE
- VOLTAGE SENSE + CAN
- JUMPERS IN CASE I DONE GOOFED
- MCU requirements:
  - 3x SPI (+1 for TCAN1146)
  - 1x UART
  - 4x GPIO in
  - 5x GPIO out
  - 2x ADC in (+5 for vcc, pyro, 5v, can 5v, and 3v3 sense)
- MOVE CAN_nCS IF NECESSARY
- FAULT is actuator pwr prot fault
- I DON'T TRUST MYSELF
- CAN transceivers
- (near R3) Add termination resistor
- Pins 5 and 8 should have an integrated pulldown so no external pulldown is used. Pg. 4 of datasheet
- added 100n cap here
- (near R4) Add termination resistor
- disconnected 3V3 and added TPs
- CHANGED VDDA
- (near U6) Multiple CAN_INH pulldowns in PWR_MGMT
- WAKE switch
- CAN_INH GOES TO V_SUP
- MCU and NAV status LEDs
- Debug interface
- Boot switch
- Reset switch
- (near C29) Crystals
- (near J6) 10-pin JTAG header (J-link EDU compatible)
- UPDATED BUZZ LED
- UNLABELLED RESISTORS ARE JUMPERS

### Library data of the parts
C1 C2 C6 C22-C25 C27 C30 C31 = CMP-2008-02046-2: CAP CER 0.1UF 10V X5R 0402; Manufacturer: Kemet; Material: Ceramic; Capacitance: 0.10 μF; Temperature Coefficient: 15%; Tolerance: 0.1; Value: 0.10 μF; Package: C0402-BB; Temperature: -55°C to +125°C; ComponentLink2Description: Datasheet; Temperature Characteristic: X5R; Device Class L1: Passive Components; Height: 0.55mm; Lead Free: Yes; ComponentLink2URL: https://content.kemet.com/datasheets/KEM_C1002_X7R_SMD.pdf; Device Class L2: Capacitors; Temperature Range Low: -55°C; Temperature Range High: +125°C; RoHS: TRUE; Octopart: https://octopart.com/c0402c104k8pactu-kemet-140039; Automotive: No; Mouser Description: Capacitor 100 nF 10 VDC 0402; Category: Cap; Voltage Rating: 10 V; Digikey Description: CAP CER 0.1UF 10V X5R 0402; Ipc Land Pattern Name: CAPC10050X50; Device Class L3: Ceramic Capacitors; Manufacturer Part Number: C0402C104K8PACTU
C3 = CMP-2000-05997-2: CAP CER 4.7UF 10V X5R 0402; Dielectric Material: Ceramic; Tolerance: 10%; Series: C; Package Quantity: 10000; Max Operating Temperature: 85°C; Case Code (Imperial): 0402; Lead Free: Lead Free; Voltage Rating (DC): 10V; Packaging: Cut Tape; Voltage Rating: 10V; Min Operating Temperature: -55°C; Dielectric: X5R; Thickness: 0.022inch; Width: 0.02inch; Case/Package: 0402; Case Code (Metric): 1005; Capacitance: 4.7uF; Length: 0.039inch; RoHS Compliant: Yes; REACH SVHC: No SVHC; Mount: Surface Mount
C4 C5 C7-C9 C11 C13 C17 C19 C21 = CMP-2100-03641-2: CAP CER 0.1UF 16V X7R 0402; Manufacturer: Murata; Standoff Height: 0mm; Tolerance: 10%; Voltage Rating: 16Vdc; Material: Ceramic; Capacitance: 0.10μF; Value: 0.10μF; RoHS: TRUE; Manufacturer Part Number: GRM155R71C104KA88D; Temperature Characteristic: X7R; Octopart: https://octopart.com/grm155r71c104ka88d-murata-196880; Digikey Description: CAP CER 0.1UF 16V X7R 0402; Device Class L3: Ceramic Capacitors; Height: 0.55mm; ComponentLink2Description: Datasheet; Temperature Range Low: -55°C; Ipc Land Pattern Name: CAPC10050X219; ComponentLink2URL: https://search.murata.co.jp/Ceramy/image/img/A01X/G101/ENG/GRM155R71H471KA01-01A.pdf; Device Class L1: Passive Components; Lead Free: yes; Category: Cap; Package: GRM15; Temperature: -55°C to +125°C; Device Class L2: Capacitors; Temperature Range High: +125°C; Mouser Description: 0402 0.1 uF 16V ±10 % Tolerance X7R SMT Multilayer Ceramic Capacitor
C10 C18 C20 = CMP-14477-000104-2: None; Tolerance: 10%; Voltage Rating: 16V; Dielectric: X5R; Capacitance: 1uF; Packaging: Tape and Reel; Depth: 0.5mm; Mount: Surface Mount; Thickness: 0.022inch; Package Quantity: 1; Min Operating Temperature: -55°C; Series: M; Voltage Rating (DC): 16V; Termination: SMD/SMT; Case/Package: 0402; Number of Pins: 2; Case Code (Imperial): 0402; Length: 1mm; Halogen Free: Halogen Free; Case Code (Metric): 1005; Width: 0.02inch; RoHS Compliant: Yes; Radiation Hardening: No; Max Operating Temperature: 85°C; Height: 0.5mm; Construction: Flat
C12 C14 = CMP-08246-004344-1: CAP CER 2.2UF 10V X7S 0402; Dielectric Material: Ceramic; Tolerance: 10%; Mount: Surface Mount; Height: 0.5mm; Package Quantity: 1; Depth: 0.5mm; RoHS Compliant: Yes; Length: 1mm; Thickness: 0.022inch; Packaging: Tape and Reel; Capacitance: 2.2uF; Case Code (Imperial): 0402; Resistor Type: Ceramic; Dielectric: X7S; Case/Package: 0402; Min Operating Temperature: -55°C; Voltage Rating: 10V; Series: C; Weight: 2.3E-05oz; Width: 0.02inch; Voltage Rating (DC): 10V; Case Code (Metric): 1005; Max Operating Temperature: 125°C; Termination: SMD/SMT; Lead Free: Lead Free
C26 = CMP-13271-000002-1: CAP CER 10UF 10V X5R 0402; Manufacturer: Samsung; Temperature Coefficient: 15%; Tolerance: 20%; Material: Ceramic; Octopart: https://octopart.com/cl05a106mp5nunc-samsung-22457395; Voltage Rating: 10V; RoHS: TRUE; Value: 10uF; Height: 0.7mm; Digikey Description: CAP CER 10UF 10V X5R 0402; Automotive: No; Package: CL05A106MP5NUNC; Device Class L1: Passive Components; Capacitance: 10uF; Temperature Range High: +85°C; ComponentLink2Description: Datasheet; Device Class L2: Capacitors; Temperature Characteristic: X5R; Manufacturer Part Number: CL05A106MP5NUNC; Temperature: -55°C to +85°C; ComponentLink2URL: http://www.samsungsem.com/kr/support/product-search/mlcc/__icsFiles/afieldfile/2019/05/10/19-CL05A106MP5NUNC.pdf; Device Class L3: Ceramic Capacitors; Category: Cap; Temperature Range Low: -55°C; Ipc Land Pattern Name: CAPC10050X50; Lead Free: Yes
C28 C29 = CMP-1034-00517-3: CAP CER 6.8PF 50V NP0 0402; Manufacturer: Kemet; Material: Ceramic; Temperature Characteristic: C0G; Tolerance: 0.25 pF; Temperature Coefficient: 15%; ComponentLink2URL: https://content.kemet.com/datasheets/KEM_C1002_X7R_SMD.pdf; Octopart: https://octopart.com/c0402c689c5gactu-kemet-9143567; RoHS: TRUE; Temperature: -55°C to +125°C; Device Class L2: Capacitors; ComponentLink2Description: Datasheet; Mouser Description: Cap Ceramic 6.8pF 50V C0G 0.25pF SMD 0402 125°C Paper T/R; Device Class L3: Ceramic Capacitors; Digikey Description: CAP CER 6.8PF 50V NP0 0402; Temperature Range High: +125°C; Package: C0402-BB; Voltage Rating: 50 V; Height: 0.55mm; Ipc Land Pattern Name: CAPC10050X50; Value: 6.8 pF; Device Class L1: Passive Components; Category: Cap; Manufacturer Part Number: C0402C689C5GACTU; Capacitance: 6.8 pF; Lead Free: Yes; Automotive: No; Temperature Range Low: -55°C
C32 C33 = CMP-2008-02590-2: General Purpose Ceramic Capacitor, 0402, 18pF, 1%, C0G, 30ppm/°C, 50V; Depth: 0.5mm; Packaging: Tape and Reel; Number of Pins: 2; Tolerance: 1%; Min Operating Temperature: -55°C; Capacitance: 18pF; Termination: SMD/SMT; Lead Free: Lead Free; Case Code (Metric): 1005; Radiation Hardening: No; Package Quantity: 1; Max Operating Temperature: 125°C; Voltage Rating: 50V; Construction: Flat; Dielectric: C0G; Length: 1mm; REACH SVHC: No SVHC; Case Code (Imperial): 0402; Series: -; RoHS Compliant: Yes; Voltage Rating (DC): 50V; Mount: Surface Mount; Case/Package: 0402; Width: 0.5mm; Thickness: 0.022inch; Contact Plating: Tin
D2 D4 = CMP-004-00040-2: Led, Red/Grn, 180Mcd/230Mcd, 624Nm/525Nm Rohs Compliant: Yes; Source: rgled.SchLib; Component Type: Standard; Design Item ID: CMP-004-00034-2; Pins: 4
FB1 = CMP-0686-00252-4: Chip Ferrite Bead, 0402, 600Ω @ 100MHz, 0.23Ω, 25%, 900mA; Number of Circuits: 1; Impedance: 600R; DC Resistance (DCR): 230mR; Material: Steel; Length: 1mm; Package Quantity: 10000; Height: 0.5mm; Width: 0.5mm; Max DC Current: 900mA; Number of Lines: 1; Termination: SMD/SMT; Packaging: Tape and Reel; Lead Free: Lead Free; Min Operating Temperature: -55°C; Max Operating Temperature: 125°C; Max Current Rating: 900mA; Case Code (Imperial): 0402; Number of Pins: 2; Current Rating: 900mA; Test Frequency: 100MHz; Case/Package: 0402; Tolerance: 25%; Case Code (Metric): 1005
J6 = CMP-002-00041-5: Board Connector, 10 Contact(s), 2 Row(s), Male, Right Angle, 0.05 inch Pitch, Surface Mount Terminal, Locking, Black Insulator; Connector Type: BOARD CONNECTOR; Mounting Technology: Board; RoHS Compliant: Yes
R1 R2 R6 R8 R10 R29 = CMP-1012-00623-3: Chip Resistor, 10 KOhm, +/- 1%, 0.1 W, -55 to 155 degC, 0603 (1608 Metric), RoHS, Tape and Reel; Manufacturer: Panasonic; Voltage Rating: 75V; Case\/Package: 0603; Power Rating: 100mW; Resistance: 10KOhm; Temperature Coefficient: 100ppm\/degreesC; Number of Pins: 2; Package Reference: 603; Depth: 0.8mm; Mount: SurfaceMount; Package Description: 2-Pin Surface Mount Device, Body 1.6 x 0.85 mm; Datasheet Version: 02/2017; Length: 1.6mm; Lead Free: LeadFree; Height: 0.45mm; Number of Terminations: 2; Max Power Dissipation: 100mW; Min Operating Temperature: -55degC; Datasheet URL: https://industrial.panasonic.com/cdbs/www-data/pdf/RDA0000/AOA0000C304.pdf; Termination: SMD/SMT; Case Code (Metric): 1608; Case Code (Imperial): 0603; Tolerance: 1%; Max Operating Temperature: 155degC; RoHSCompliant: true; Voltage Rating (DC): 75V; Radiation Hardening: No; Packaging: TapeandReel; Composition: ThickFilm; Mounting Technology: SurfaceMount; Manufacturer URL: http://www.panasonic.com/; Width: 0.031inch; REACH SVHC: NoSVHC; Contact Plating: Tin; Military Standard: Not; Package Quantity: 1
R3-R5 = CMP-2000-00213-2: Chip Resistor, 120 Ohm, +/- 1%, 0.1 W, -55 to 155 degC, 0603 (1608 Metric), RoHS, Tape and Reel; Manufacturer: Panasonic; Power Rating: 100mW; Voltage Rating (DC): 75V; Resistance: 120Ohm; Temperature Coefficient: 100ppm/degreesC; Number of Terminations: 2; Military Standard: Not; Tolerance: 1%; Min Operating Temperature: -55degC; Packaging: TapeandReel; Lead Free: LeadFree; Max Operating Temperature: 155degC; Manufacturer URL: http://www.panasonic.com/; Case Code (Imperial): 0603; REACH SVHC: NoSVHC; Width: 0.031inch; Datasheet URL: https://industrial.panasonic.com/cdbs/www-data/pdf/RDA0000/AOA0000C283.pdf; RoHSCompliant: true; Max Power Dissipation: 100mW; Termination: SMD/SMT; Package Reference: 0603; Height: 0.022inch; Depth: 0.8mm; Package Description: 2-Pin Surface Mount Device, Body 1.6 x 0.85 mm; Contact Plating: Tin; Length: 1.6mm; Package URL: http://www.st.com/st-web-ui/static/active/en/resource/technical/document/datasheet/CD00001320.pdf; Radiation Hardening: No; Package Quantity: 1; Number of Pins: 2; Datasheet Version: 42095.0; Voltage Rating: 75V; Composition: ThickFilm; Case/Package: 0603; Mount: SurfaceMount; Case Code (Metric): 1608
R7 = CMP-2000-00180-1: Manufacturer: Panasonic; Part Number: ERJ-3EKF1001V
R22 R25 R28 R30 = CMP-2000-00572-1: Manufacturer: Panasonic; Part Number: ERJ3EKF56R0V
R26 R27 = CMP-2000-00435-2: Chip Resistor, 330 Ohm, +/- 1%, 0.1 W, -55 to 155 degC, 0603 (1608 Metric), RoHS, Tape and Reel; Gender: Male; Mating Cycles: 10000; Current Rating: 500 mA; Voltage Rating: 10 V; REACH SVHC: No SVHC; PackageDescription: 2-Pin Surface Mount Device, Body 1.6 x 0.85 mm; Contact Finish: Gold; Pins: 8; ComponentLink1Description: Manufacturer URL; Packaging: Tape and Reel; Max Operating Temperature: 85 degC; Contact Material: Copper; Height: 1.45 mm; Width: 1.45 mm; DatasheetVersion: Apr-15; Package Quantity: 1500; Contact Plating: Gold; PackageReference: 0603; Mount: Surface Mount; Lead Pitch: 1.1 mm; Min Operating Temperature: -25 degC; ComponentLink1URL: http://www.panasonic.com/; ComponentLink2URL: http://industrial.panasonic.com/cdbs/www-data/pdf/RDA0000/AOA0000C86.pdf; Length: 13.7 mm; ComponentLink2Description: Datasheet; RoHSCompliant: true
R83 R84 = CMP-009-00118-2: READ THE NAME; Pins: 2; Component Type: Standard; Design Item ID: CMP-009-00206-2; Source: 0402jump.SchLib
SW1-SW3 = CMP-10040-000029-1: SWITCH TACTILE SPST-NO 0.02A 15V; Operating Force: 240gf; Switch Travel: 0.13mm; Illumination Type: Non-Illuminated; Throw Configuration: SPST; Number of Ports: 1; Current Rating: 5A; Mechanical Life: 500000Cycles; Switch Function: Off-Mom; Connector Type: USB; Actuator Type: Standard; Gender: Receptacle; Number of Contacts: 24; Contact Plating: Gold; Insulation Color: Black; Min Operating Temperature: -40°C; Packaging: Tape and Reel; Flammability Rating: UL94 V-0; Max Operating Temperature: 85°C; Termination: Solder; Mount: Surface Mount
TP5-TP7 = CMP-00028-00002-2: 0.6mm round; Pins: 1
U1 = CMP-12105-000107-1: IC MCU 32BIT 128KB FLASH 100LQFP
U2 U5 = CMP-04872-000178-1: IC TRANSCEIVER 1/1 SOT23-8; Data Rate: 1Mbps; Packaging: Tape and Reel; Min Operating Temperature: -40°C; Max Operating Temperature: 125°C; RoHS Compliant: Yes; Lead Free: Lead Free; Case/Package: SOT-23-8; Mount: Surface Mount
U6 = CMP-318-000000-2: Automotive CAN FD transceiver with watchdog, bus diagnostics and partial networking via sele 14-SOT-23-THIN -40 to 150; Component Type: Standard; Design Item ID: CMP-015-00012-2; Pin Count: 14; Source: TCAN1146DYYRQ1.SchLib
U7 = CMP-019-00041-1: Ldo Cmos Lowcurr SOT23 T&r 3K
Y1 = CMP-27762-011708-1: Crystal 48MHz ±20ppm 18pF SMD-4 3.2mm x 2.5mm; Series Resistance: 35R; Frequency Stability: 50ppm; Package Quantity: 1000; Packaging: Tape and Reel; Mount: Surface Mount; Length: 3.2mm; Load Capacitance: 18pF; Max Operating Temperature: 70°C; Operating Frequency: 48 MHz; RoHS Compliant: Yes; Series: ABM8; Frequency Tolerance: 20ppm; Lead Free: Lead Free; Min Operating Temperature: -20°C; Case/Package: CSMD; Number of Pins: 4; Height: 0.031inch; ESR (Equivalent Series Resistance): 35R; Frequency: 48MHz; Radiation Hardening: No; Width: 0.098inch; Tolerance: 20ppm; Termination: SMD/SMT; Depth: 2.5mm; Resistor Type: Ceramic; REACH SVHC: No SVHC
Y2 = CMP-40224-000006-1: CRYSTAL 32.7680KHZ 12.5PF SMD; Manufacturer: ECS International; Frequency: 32.768kHz; Esr: 90kΩ; Tolerance: 20ppm; Device Class L1: Passive Components; Load Capacitance: 12.5pF; Temperature: -40°C to +85°C; ComponentLink2URL: https://ecsxtal.com/store/pdf/ECX-1210.pdf; Series: ECX-1210; Octopart: https://octopart.com/ecs-.327-12.5-1210-tr-ecs+international-81221340; ComponentLink2Description: Datasheet; Temperature Range Low: -40°C; Digikey Description: CRYSTAL 32.7680KHZ 12.5PF SMD; Lead Free: Yes; RoHS: TRUE; Device Class L3: Crystals; Automotive: No; Category: Crys; Height: 0.5mm; Manufacturer Part Number: ECS-.327-12.5-1210-TR; Temperature Range High: +85°C; Device Class L2: Crystals / Oscillators; Package: ECX-1210

## Sheet IMU.SchDoc
size B; SheetNumber: 4; SheetTotal: 7
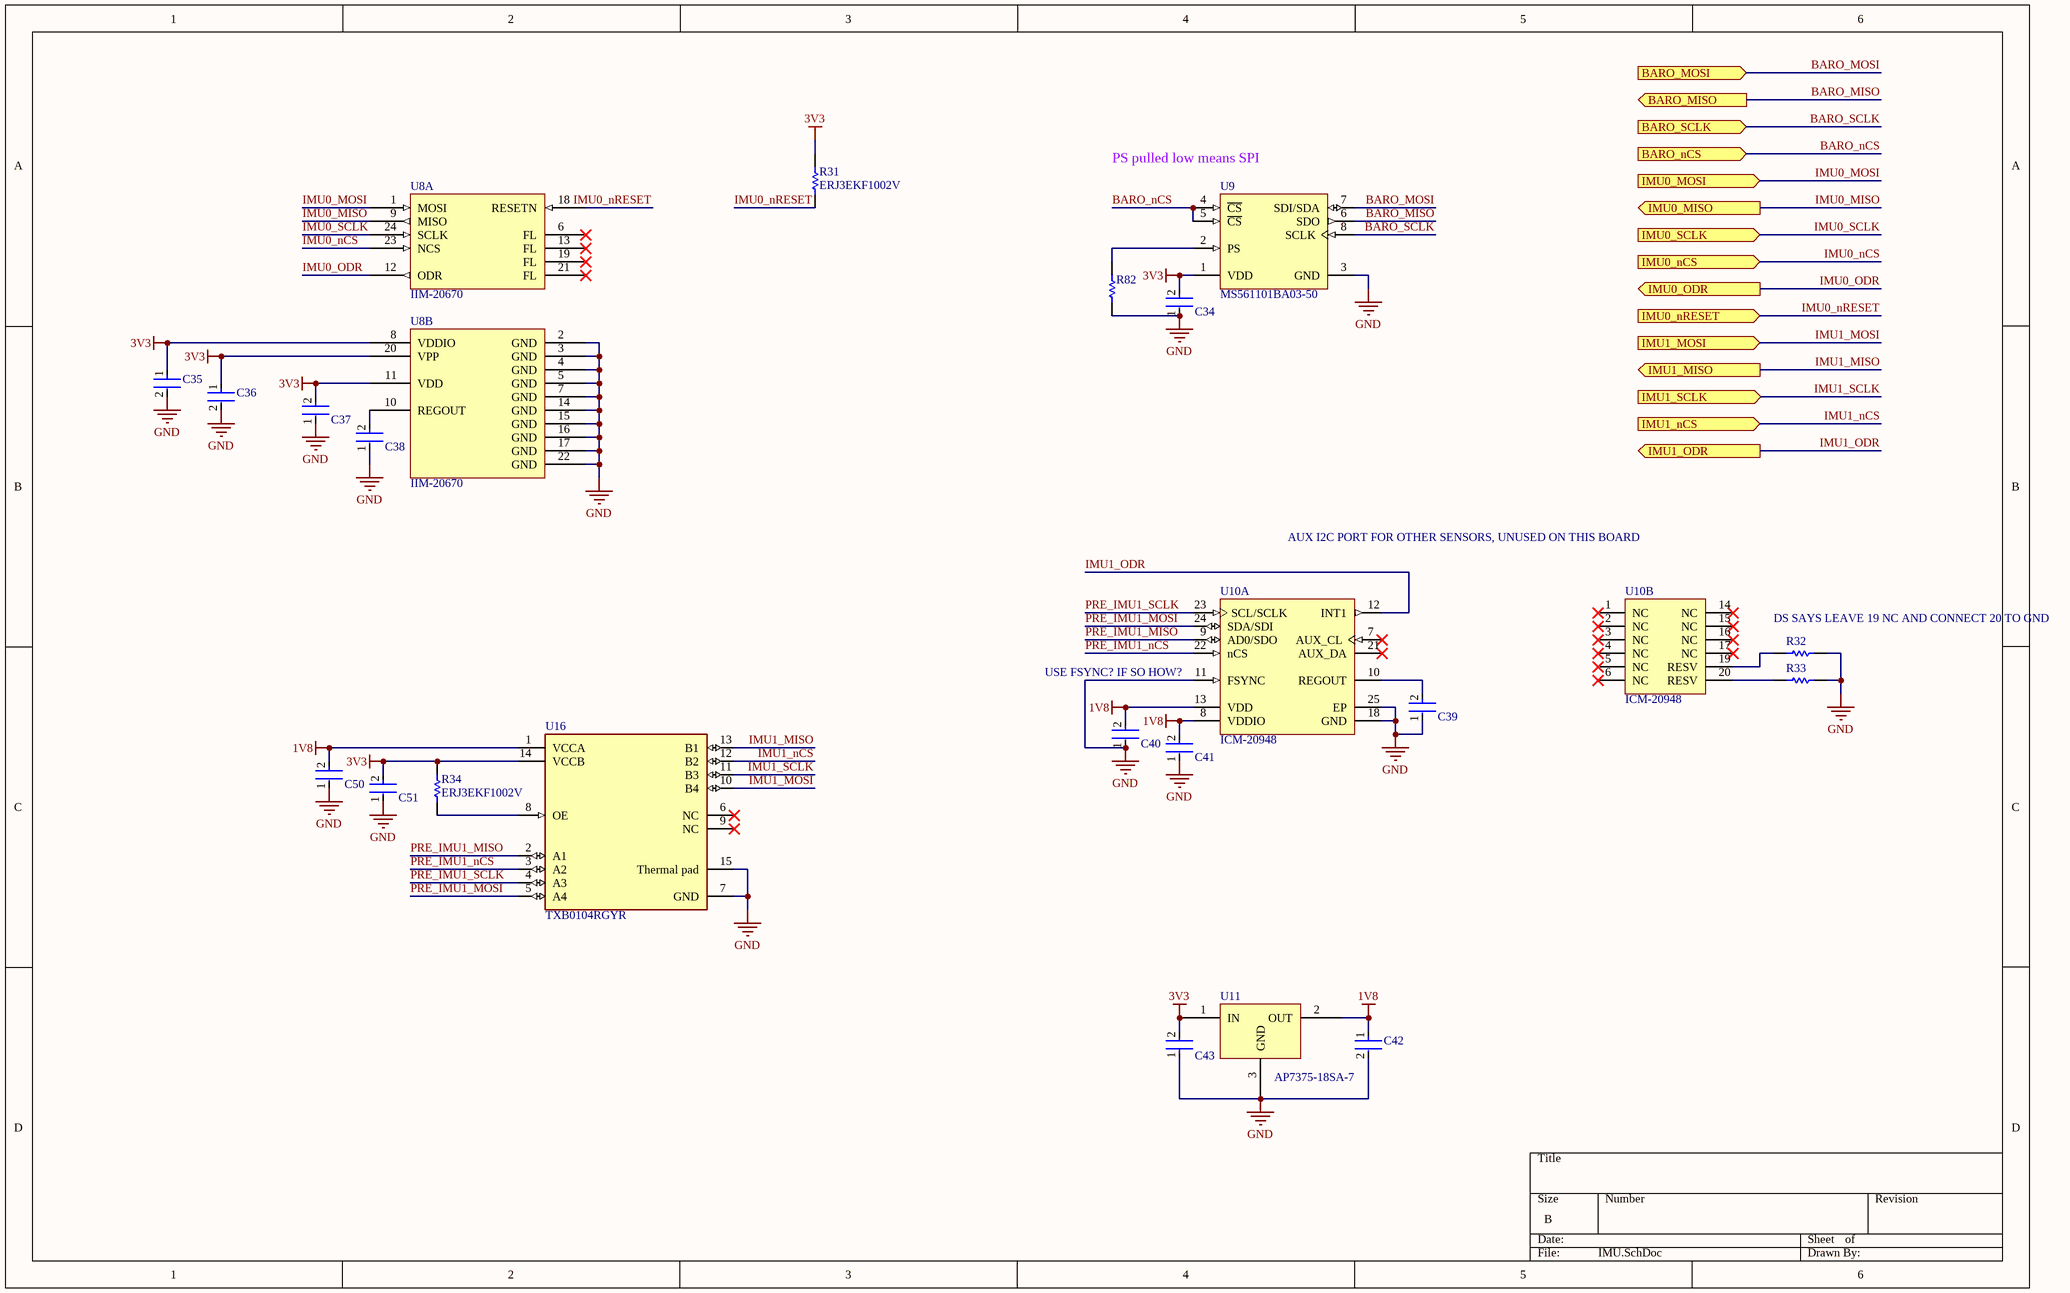
[diagram p5: IMU.SchDoc]

### Parts
C34  GRM155R71C104KA88D  [FP-GRM15-MFG]  (value not drawn)
C35  CC0402KPX7R7BB103  [FP-CC0402-MFG]  (value not drawn)
C36  CC0402KPX7R7BB103  [FP-CC0402-MFG]  (value not drawn)
C37  GRM155R71C104KA88D  [FP-GRM15-MFG]  (value not drawn)
C38  GRM155R71C104KA88D  [FP-GRM15-MFG]  (value not drawn)
C39  GRM155R71C104KA88D  [FP-GRM15-MFG]  (value not drawn)
C40  GRM155R71C104KA88D  [FP-GRM15-MFG]  (value not drawn)
C41  GRM155R71C104KA88D  [FP-GRM15-MFG]  (value not drawn)
C42  CL05A106MP5NUNC  [FP-CL05A106MP5NUNC-MFG]  (value not drawn)
C43  C0402C104K8PACTU  [FP-C0402-BB-MFG]  (value not drawn)
C50  GRM155R71C104KA88D  [FP-GRM15-MFG]  (value not drawn)
C51  GRM155R71C104KA88D  [FP-GRM15-MFG]  (value not drawn)
R31  ERJ3EKF1002V  [RESC1609X55X30LL15T15]
R32  0402 JUMPER  [RESC1005X40X25ML05T05]  (value not drawn)
R33  0402 JUMPER  [RESC1005X40X25ML05T05]  (value not drawn)
R34  ERJ3EKF1002V  [RESC1609X55X30LL15T15]
R82  0402 JUMPER  [RESC1005X40X25ML05T05]  (value not drawn)
U8  IIM-20670  [PQFN50P450X450X115_HS-25N]  (parts A,B of 2)
U9  MS561101BA03-50  [MSI-MS561101BA03-50-8_V]
U10  ICM-20948  [TDK-QFN-24_L]  (parts A,B of 2)
U11  AP7375-18SA-7  [AP7375-18SA-7-Footprint-1]
U16  TXB0104RGYR  [FP-RGY0014A-MFG]

### Ports
BARO_MISO (out, see HYDRA_V3_NAV[5A], STM32H730_PINOUT[7A]), BARO_MOSI (in, see HYDRA_V3_NAV[5A], STM32H730_PINOUT[7A]), BARO_nCS (in, see HYDRA_V3_NAV[5B], STM32H730_PINOUT[7A]), BARO_SCLK (in, see HYDRA_V3_NAV[5A], STM32H730_PINOUT[7A]), IMU0_MISO (out, see HYDRA_V3_NAV[5A], STM32H730_PINOUT[7A]), IMU0_MOSI (in, see HYDRA_V3_NAV[5A], STM32H730_PINOUT[7A]), IMU0_nCS (in, see HYDRA_V3_NAV[5A], STM32H730_PINOUT[7A]), IMU0_nRESET (in, see HYDRA_V3_NAV[5A]), IMU0_ODR (out, see HYDRA_V3_NAV[5A]), IMU0_SCLK (in, see HYDRA_V3_NAV[5A], STM32H730_PINOUT[7A]), IMU1_MISO (out, see HYDRA_V3_NAV[5A], STM32H730_PINOUT[7A]), IMU1_MOSI (in, see HYDRA_V3_NAV[5A], STM32H730_PINOUT[7A]), IMU1_nCS (in, see HYDRA_V3_NAV[5A], STM32H730_PINOUT[7A]), IMU1_ODR (out, see HYDRA_V3_NAV[5A], STM32H730_PINOUT[7A]), IMU1_SCLK (in, see HYDRA_V3_NAV[5A], STM32H730_PINOUT[7A])

### Nets
1V8: C40.2 C41.2 C42.1 C50.2 U10.8(VDDIO) U10.13(VDD) U11.2(OUT) U16.1(VCCA)
3V3: C34.2 C35.1 C36.1 C37.2 C43.2 C51.2 R31.2 R34.2 U8.8(VDDIO) U8.11(VDD) U8.20(VPP) U9.1(VDD) U11.1(IN) U16.14(VCCB)
GND: C34.1 C35.2 C36.2 C37.1 C38.1 C39.1 C40.1 C41.1 C42.2 C43.1 C50.1 C51.1 R32.2 R33.2 R82.1 U8.2(GND) U8.3(GND) U8.4(GND) U8.5(GND) U8.7(GND) U8.14(GND) U8.15(GND) U8.16(GND) U8.17(GND) U8.22(GND) U9.3(GND) U10.11(FSYNC) U10.18(GND) U10.25(EP) U11.3(GND) U16.7(GND) U16.15(Thermal_pad)
BARO_MISO: U9.6(SDO) ; port BARO_MISO
BARO_MOSI: U9.7(SDI/SDA) ; port BARO_MOSI
BARO_nCS: U9.4(~{CS}) U9.5(~{CS}) ; port BARO_nCS
BARO_SCLK: U9.8(SCLK) ; port BARO_SCLK
IMU0_MISO: U8.9(MISO) ; port IMU0_MISO
IMU0_MOSI: U8.1(MOSI) ; port IMU0_MOSI
IMU0_nCS: U8.23(NCS) ; port IMU0_nCS
IMU0_nRESET: R31.1 U8.18(RESETN) ; port IMU0_nRESET
IMU0_ODR: U8.12(ODR) ; port IMU0_ODR
IMU0_SCLK: U8.24(SCLK) ; port IMU0_SCLK
IMU1_MISO: U16.13(B1) ; port IMU1_MISO
IMU1_MOSI: U16.10(B4) ; port IMU1_MOSI
IMU1_nCS: U16.12(B2) ; port IMU1_nCS
IMU1_ODR: U10.12(INT1) ; port IMU1_ODR
IMU1_SCLK: U16.11(B3) ; port IMU1_SCLK
PRE_IMU1_MISO: U10.9(AD0/SDO) U16.2(A1)
PRE_IMU1_MOSI: U10.24(SDA/SDI) U16.5(A4)
PRE_IMU1_nCS: U10.22(nCS) U16.3(A2)
PRE_IMU1_SCLK: U10.23(SCL/SCLK) U16.4(A3)
NetC38_2: C38.2 U8.10(REGOUT)
NetC39_2: C39.2 U10.10(REGOUT)
NetR32_1: R32.1 U10.19(RESV)
NetR33_1: R33.1 U10.20(RESV)
NetR34_1: R34.1 U16.8(OE)
NetR82_2: R82.2 U9.2(PS)

Not connected (* = marked no-connect by the designer): U8 6(FL)* 13(FL)* 19(FL)* 21(FL)*; U10 1(NC)* 2(NC)* 3(NC)* 4(NC)* 5(NC)* 6(NC)* 7(AUX_CL)* 14(NC)* 15(NC)* 16(NC)* 17(NC)* 21(AUX_DA)*; U16 6(NC)* 9(NC)*

### Notes on the sheet
- (near U9) PS pulled low means SPI
- AUX I2C PORT FOR OTHER SENSORS, UNUSED ON THIS BOARD
- (near R32) DS SAYS LEAVE 19 NC AND CONNECT 20 TO GND
- USE FSYNC? IF SO HOW?

### Library data of the parts
C34 C37-C41 C50 C51 = CMP-2100-03641-2: as C4 on sheet STM32H730_PINOUT; RoHS: TRUE; Manufacturer Part Number: GRM155R71C104KA88D; Temperature Characteristic: X7R; Octopart: https://octopart.com/grm155r71c104ka88d-murata-196880; Digikey Description: CAP CER 0.1UF 16V X7R 0402; Device Class L3: Ceramic Capacitors; Height: 0.55mm; ComponentLink2Description: Datasheet; Temperature Range Low: -55°C; Ipc Land Pattern Name: CAPC10050X219; ComponentLink2URL: https://search.murata.co.jp/Ceramy/image/img/A01X/G101/ENG/GRM155R71H471KA01-01A.pdf; Device Class L1: Passive Components; Lead Free: yes; Category: Cap; Package: GRM15; Temperature: -55°C to +125°C; Device Class L2: Capacitors; Temperature Range High: +125°C; Mouser Description: 0402 0.1 uF 16V ±10 % Tolerance X7R SMT Multilayer Ceramic Capacitor
C35 C36 = CMP-03422-000420-1: CC0402 10 nF X7R 10.00% 16 V; Manufacturer: YAGEO; Capacitance: 10 nF; Value: 10 nF; Tolerance: 0.1; Voltage Rating: 16 V; Automotive Grade: NA; Temperature Coefficient: 30ppm/°C; Material: Ceramic; Automotive: No; Device Class L1: Passive Components; Temperature Range Low: -55°C; Ipc Land Pattern Name: CAPC10050X50; Temperature Characteristic: X7R; Lead Free: Yes; Footprint Url: http://www.yageo.com/exep/pages/download/literatures/UPY-C_GEN_24.pdf; Octopart: https://octopart.com/cc0402kpx7r7bb103-yageo-12885102; RoHS: TRUE; Height: 0.55mm; Device Class L3: Ceramic Capacitors; Mouser Description: Multilayer Ceramic Capacitors MLCC - SMD/SMT 10nF 16V X7R 10%; Package: CC0402; ComponentLink2Description: Datasheet; Category: Cap; ComponentLink2URL: http://www.yageo.com/documents/recent/UPY-GP_NP0_16V-to-50V_16.pdf; Temperature: -55°C to +125°C; Manufacturer Part Number: CC0402KPX7R7BB103; Temperature Range High: +125°C; Device Class L2: Capacitors
C42 = CMP-13271-000002-1: as C26 on sheet STM32H730_PINOUT; Octopart: https://octopart.com/cl05a106mp5nunc-samsung-22457395; Voltage Rating: 10V; RoHS: TRUE; Value: 10uF; Height: 0.7mm; Digikey Description: CAP CER 10UF 10V X5R 0402; Automotive: No; Package: CL05A106MP5NUNC; Device Class L1: Passive Components; Capacitance: 10uF; Temperature Range High: +85°C; ComponentLink2Description: Datasheet; Device Class L2: Capacitors; Temperature Characteristic: X5R; Manufacturer Part Number: CL05A106MP5NUNC; Temperature: -55°C to +85°C; ComponentLink2URL: http://www.samsungsem.com/kr/support/product-search/mlcc/__icsFiles/afieldfile/2019/05/10/19-CL05A106MP5NUNC.pdf; Device Class L3: Ceramic Capacitors; Category: Cap; Temperature Range Low: -55°C; Ipc Land Pattern Name: CAPC10050X50; Lead Free: Yes
C43 = CMP-2008-02046-2: as C1 on sheet STM32H730_PINOUT; Package: C0402-BB; Temperature: -55°C to +125°C; ComponentLink2Description: Datasheet; Temperature Characteristic: X5R; Device Class L1: Passive Components; Height: 0.55mm; Lead Free: Yes; ComponentLink2URL: https://content.kemet.com/datasheets/KEM_C1002_X7R_SMD.pdf; Device Class L2: Capacitors; Temperature Range Low: -55°C; Temperature Range High: +125°C; RoHS: TRUE; Octopart: https://octopart.com/c0402c104k8pactu-kemet-140039; Automotive: No; Mouser Description: Capacitor 100 nF 10 VDC 0402; Category: Cap; Voltage Rating: 10 V; Digikey Description: CAP CER 0.1UF 10V X5R 0402; Ipc Land Pattern Name: CAPC10050X50; Device Class L3: Ceramic Capacitors; Manufacturer Part Number: C0402C104K8PACTU
R31 R34 = CMP-1012-00623-3: as R1 on sheet STM32H730_PINOUT; Number of Pins: 2; Package Reference: 603; Depth: 0.8mm; Mount: SurfaceMount; Package Description: 2-Pin Surface Mount Device, Body 1.6 x 0.85 mm; Datasheet Version: 02/2017; Length: 1.6mm; Lead Free: LeadFree; Height: 0.45mm; Number of Terminations: 2; Max Power Dissipation: 100mW; Min Operating Temperature: -55degC; Datasheet URL: https://industrial.panasonic.com/cdbs/www-data/pdf/RDA0000/AOA0000C304.pdf; Termination: SMD/SMT; Case Code (Metric): 1608; Case Code (Imperial): 0603; Tolerance: 1%; Max Operating Temperature: 155degC; RoHSCompliant: true; Voltage Rating (DC): 75V; Radiation Hardening: No; Packaging: TapeandReel; Composition: ThickFilm; Mounting Technology: SurfaceMount; Manufacturer URL: http://www.panasonic.com/; Width: 0.031inch; REACH SVHC: NoSVHC; Contact Plating: Tin; Military Standard: Not; Package Quantity: 1
R32 R33 R82 = CMP-009-00118-2: READ THE NAME; Pins: 2; Component Type: Standard; Design Item ID: CMP-009-00206-2; Source: 0402jump.SchLib
U8 = CMP-010-00029-2: 6-axis IMU with extended temperature range and high VRE performance
U9 = CMP-2000-05251-1: Barometric Pressure Sensor, with Stainless Steel Cap, 1.8 to 3.6 V, -45 to 85 degC, 8-Pin QFN, RoHS, Tape and Reel; Manufacturer: Measurement Specialties; Operating Pressure Max: 1200mbar; Supply Current: 12.5µA; Supply Voltage Max: 3.6V; Supply Voltage Min: 1.8V; No. of Pins: 8; Connection Size: 0.5mm; SVHC: NoSVHC(20-Jun-2013); Operating Pressure Min: 10mbar; Manufacturer URL: http://www.meas-spec.com/; Operating Temperature Min: -40degC; Pressure Type: Barometric; Package Reference: MS561101BA03-50-8; Datasheet URL: http://www.te.com/commerce/DocumentDelivery/DDEController?Action=srchrtrv&DocNm=MS5611-01BA03&DocType=Data+Sheet&DocLang=English&DocFormat=pdf&PartCntxt=CAT-BLPS0036; Package Description: 8-Pin Surface Mount Device, Body 5 x 3 mm, Pitch 1.25 mm; Sensor Case Style: QFN; Datasheet Version: Sep-15; Operating Temperature Max: 85degC
U10 = CMP-2000-07532-1: World’s Lowest Power 9-Axis MEMS MotionTracking(TM) Device, 1.71 to 3.6 V, -40 to 85 degC, 24-Pin QFN, RoHS, Tape and Reel; Manufacturer: TDK; Package Description: 24-Pin Quad Flat No-lead Package, Body 3 x 3 mm, Pitch 0.4 mm; Datasheet Version: Rev. 1.3, 06/2017; Package Reference: QFN-24; Mounting Technology: SurfaceMount; Datasheet URL: https://www.invensense.com/wp-content/uploads/2016/06/DS-000189-ICM-20948-v1.3.pdf; Manufacturer URL: http://www.tdk.com/
U11 = CMP-019-00042-1: Fixed Positive LDO Regulator; RoHS Compliant: Yes
U16 = CMP-04899-000011-1: IC TRNSLTR BIDIRECTIONAL 14VQFN; Manufacturer: Texas Instruments; Standoff Height: 0mm; V B Min: 1.65V; Data Rate: 100Mbits/s; Number Of Circuits: 1; V B Max: 5.5V; Number Of Inputs: 4; Logic Function Desc: Non-Inverting; Max Junction Temp: +150°C; V A Min: 1.2V; Nominal Supply Current: 0.06-3.5uA; V A Max: 3.6V; Propagation Delay: 4ns; Device Class L1: Integrated Circuits (ICs); ComponentLink2Description: Datasheet; Mouser Description: 4-Bit Bidirectional Voltage-Level Shifter with Auto Direction Sensing and +/-15 kV ESD Protect 14-VQFN -40 to 85; Ambient Temperature Range Low: -40°C; Temperature: -40°C to +85°C; RoHS: TRUE; Digikey Description: IC TRNSLTR BIDIRECTIONAL 14VQFN; Manufacturer Part Number: TXB0104RGYR; Lead Free: Yes; Octopart: https://octopart.com/txb0104rgyr-texas+instruments-1485948; Height: 1mm; Device Class L3: Voltage Level Shifters; Category: IC; Device Class L2: Logic ICs; Temperature Range Low: -40°C; Number Of Outputs: 4; Temperature Range High: +85°C; Package: RGY0014A; Automotive: No; Ambient Temperature Range High: +85°C; Min Supply Voltage: 1.2V; ComponentLink2URL: http://www.ti.com/lit/ds/symlink/txb0104.pdf; Max Supply Voltage: 5.5V